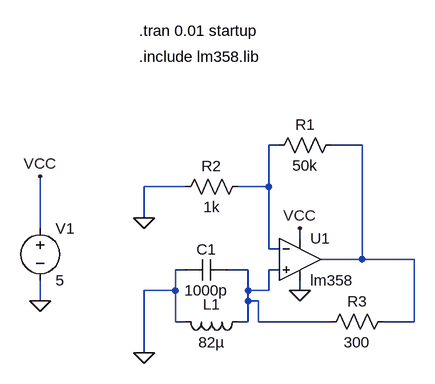
[diagram p0: schematic lc_meter.asc]
lc_meter.asc, the LTspice schematic file:
Version 4
SHEET 1 880 680
WIRE 192 -16 176 -16
WIRE 320 -16 272 -16
WIRE 48 48 -16 48
WIRE 176 48 176 -16
WIRE 176 48 128 48
WIRE -16 96 -16 48
WIRE -176 112 -176 32
WIRE 224 128 224 112
WIRE 176 144 176 48
WIRE 192 144 176 144
WIRE 320 160 320 -16
WIRE 320 160 256 160
WIRE 400 160 320 160
WIRE 48 176 32 176
WIRE 144 176 112 176
WIRE 192 176 176 176
WIRE 32 208 32 176
WIRE 32 208 -16 208
WIRE 144 208 144 176
WIRE 176 208 176 176
WIRE 176 208 144 208
WIRE 224 208 224 192
WIRE -176 224 -176 192
WIRE 144 224 144 208
WIRE 160 224 144 224
WIRE 32 256 32 208
WIRE 48 256 32 256
WIRE 144 256 144 224
WIRE 144 256 128 256
WIRE 160 256 160 224
WIRE 272 256 160 256
WIRE 400 256 400 160
WIRE 400 256 352 256
WIRE -16 304 -16 208
FLAG 224 208 0
FLAG -176 224 0
FLAG -176 32 VCC
FLAG 224 112 VCC
FLAG -16 304 0
FLAG -16 96 0
SYMBOL voltage -176 96 R0
WINDOW 123 0 0 Left 0
WINDOW 39 0 0 Left 0
SYMATTR InstName V1
SYMATTR Value 5
SYMBOL ind 144 240 R90
WINDOW 0 5 56 VBottom 2
WINDOW 3 32 56 VTop 2
SYMATTR InstName L1
SYMATTR Value 82µ
SYMBOL cap 112 160 R90
WINDOW 0 0 32 VBottom 2
WINDOW 3 32 32 VTop 2
SYMATTR InstName C1
SYMATTR Value 1000p
SYMBOL res 288 -32 R90
WINDOW 0 0 56 VBottom 2
WINDOW 3 32 56 VTop 2
SYMATTR InstName R1
SYMATTR Value 50k
SYMBOL res 144 32 R90
WINDOW 0 0 56 VBottom 2
WINDOW 3 32 56 VTop 2
SYMATTR InstName R2
SYMATTR Value 1k
SYMBOL res 368 240 R90
WINDOW 0 0 56 VBottom 2
WINDOW 3 32 56 VTop 2
SYMATTR InstName R3
SYMATTR Value 300
SYMBOL OpAmps\\opamp2 224 96 R0
SYMATTR InstName U1
SYMATTR Value lm358
TEXT -24 -192 Left 2 !.tran 0.01 startup
TEXT -24 -152 Left 2 !.include lm358.lib

The netlist it stands for:
* lc_meter.asc
V1 VCC 0 5
L1 N003 0 82µ
C1 N003 0 1000p
R1 N002 N001 50k
R2 N001 0 1k
R3 N002 N003 300
XU1 N003 N001 VCC 0 N002 lm358  ; pins In+ In- V+ V- OUT
.tran 0.01 startup
.include lm358.lib
.backanno
.end